# EAGLE design LGA-12 (EAGLE 9.6.2)
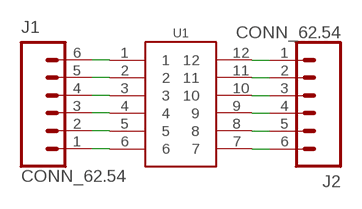
[diagram p0: schematic, sheet 1]

## Parts
J1  CONN_62.54  [1X06]
J2  CONN_62.54  [1X06]
U1  GEN_12LGA12_2X2  [LGA-12_2X2]

## Nets
N$1: J1.6 U1.1
N$2: J1.5 U1.2
N$3: J1.4 U1.3
N$4: J1.3 U1.4
N$5: J1.2 U1.5
N$6: J1.1 U1.6
N$7: J2.1 U1.12
N$8: J2.2 U1.11
N$9: J2.3 U1.10
N$10: J2.4 U1.9
N$11: J2.5 U1.8
N$12: J2.6 U1.7

## Library data of the parts
J1 J2 = bschulz:CONN_6: Genaric 6 terminal header Digikey 2.54_SCREW <https://www.digikey.com/product-detail/en/on-shore-technology-inc/OSTVN06A150/ED10565-ND/1588866>
U1 = bschulz:GEN_12: Generic 12 Pin Package for Breakout Boards

## Board
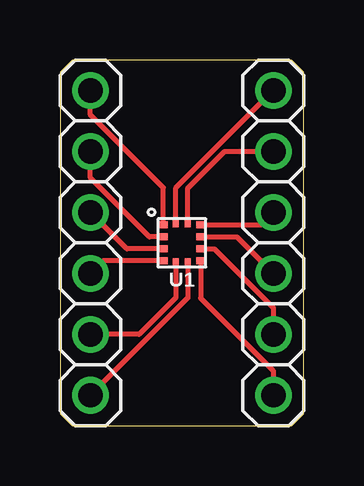
[diagram p1: board, top side]

Size 10.16 x 15.24 mm. Coordinates in mm from the lower left corner, seen from the top.
Outline: 0,14.74 0,0.5 0.5,0 9.66,0 10.16,0.5 10.16,14.74 9.66,15.24 0.5,15.24 0,14.74
Copper layers (1*16): Top 0.035559375mm / dielectric 1.6mm / Bottom 0.035559375mm
Design rules "oshpark-2layer": minimum track width 6mil, minimum drill 10mil, track to track 6mil, track to pad 6mil, pad to pad 6mil, via to via 6mil, smd to smd 6mil, copper to edge 15mil, drill to drill 6mil, minimum pad ring 5mil, minimum via ring 5mil, stop-mask expansion 2.5mil, vias tented up to drill 0mil, thermal gap 10mil

### Footprints (pad centres in the part's own frame; a part is rotated, then mirrored left to right if it is on the bottom)
1X06 = drill 1.016: 1 -6.35,0; 2 -3.81,0; 3 -1.27,0; 4 1.27,0; 5 3.81,0; 6 6.35,0
LGA-12_2X2 = smd 0.3 x 0.35: 1 -0.75,-0.775; 2 -0.25,-0.775; 3 0.25,-0.775; 4 0.75,-0.775; 7 0.75,0.775; 8 0.25,0.775; 9 -0.25,0.775; 10 -0.75,0.775 | smd 0.3 x 0.25: 5 0.8,-0.25; 6 0.8,0.25; 11 -0.8,0.25; 12 -0.8,-0.25

### Placement (x,y rotation side)
J1  1.27,7.62 90 top
J2  8.89,7.62 270 top
U1  5.08,7.62 270 top

### Tracks (layer width: path | path; a pad name or v marks a point on that pad's centre or on a via)
N$1
  Top 0.2: U1.1 4.3,9.92 1.27,12.95 J1.6
N$2
  Top 0.2: U1.2 3.73,7.87 1.27,10.32 J1.5
N$3
  Top 0.2: U1.3 2.79,7.37 J1.4
N$4
  Top 0.2: U1.4 1.79,6.87 J1.3
N$5
  Top 0.2: U1.5 4.83,5.34 3.3,3.81 J1.2
N$6
  Top 0.2: U1.6 5.33,5.33 J1.1
N$7
  Top 0.2: U1.12 4.83,9.91 J2.1
N$8
  Top 0.2: U1.11 5.33,9.9 6.86,11.43 J2.2
N$9
  Top 0.2: U1.10 8.37,8.37 J2.3
N$10
  Top 0.2: U1.9 7.37,7.87 J2.4
N$11
  Top 0.2: U1.8 6.43,7.37 8.89,4.92 J2.5
N$12
  Top 0.2: U1.7 5.86,5.32 8.89,2.29 J2.6

### Text on the board
tDocu: 1 | 12 | Break44 / B. Schulz | 2 | 11 | 3 | 10 | 4 | 9 | 5 | 8 | LGA-12 | 6 | 7